# EAGLE schematic WirelessNRF24 (EAGLE 7.3.0)
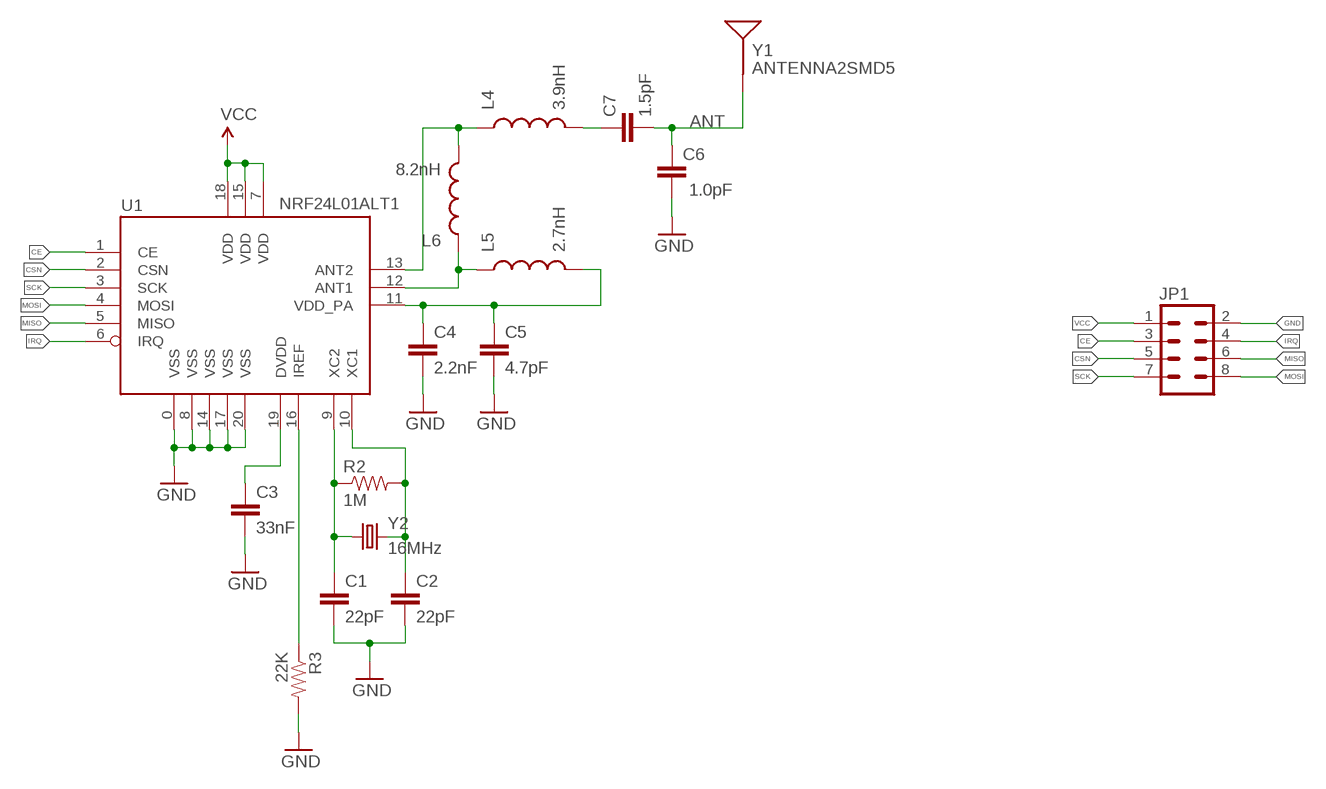
[diagram p0: schematic, sheet 1]

## Parts
C1  22pF  CAP0603-CAP  [0603-CAP]
C2  22pF  CAP0603-CAP  [0603-CAP]
C3  33nF  CAP0603-CAP  [0603-CAP]
C4  2.2nF  CAP0603-CAP  [0603-CAP]
C5  4.7pF  CAP0603-CAP  [0603-CAP]
C6  1.0pF  CAP0603-CAP  [0603-CAP]
C7  1.5pF  CAP0603-CAP  [0603-CAP]
JP1  M04X2_0.05"  [M04X2_0.05"]
L4  3.9nH  INDUCTOR0603  [0603]
L5  2.7nH  INDUCTOR0603  [0603]
L6  8.2nH  INDUCTOR0603  [0603]
R2  1M  RESISTOR0603-RES  [0603-RES]
R3  22K  RESISTOR0603-RES  [0603-RES]
U1  NRF24L01ALT1  [QFN20_ALT1]
Y1  ANTENNA2SMD5  [ANTENNA-CHIP5]
Y2  16MHz  CRYSTALTXC-7A  [CRYSTAL-TXC-7A]

## Nets
ANT: C6.2 C7.2 Y1.FEED(SIGNAL)
CE: JP1.3 U1.1(CE)
CSN: JP1.5 U1.2(CSN)
GND: C1.2 C2.2 C3.2 C4.2 C5.2 C6.1 JP1.2 R3.2 U1.0(VSS) U1.8(VSS) U1.14(VSS) U1.17(VSS) U1.20(VSS)
IRQ: JP1.4 U1.6(IRQ)
MISO: JP1.6 U1.5(MISO)
MOSI: JP1.8 U1.4(MOSI)
N$1: C1.1 R2.1 U1.9(XC2) Y2.P$1
N$2: C2.1 R2.2 U1.10(XC1) Y2.P$2
N$3: L5.1 L6.1 U1.12(ANT1)
N$4: R3.1 U1.16(IREF)
N$5: C3.1 U1.19(DVDD)
N$6: L4.1 L6.2 U1.13(ANT2)
N$7: C4.1 C5.1 L5.2 U1.11(VDD_PA)
N$9: C7.1 L4.2
SCK: JP1.7 U1.3(SCK)
VCC: JP1.1 U1.7(VDD) U1.15(VDD) U1.18(VDD)

## Library data of the parts
C1-C7 = SparkFun:CAP: Capacitor Standard 0603 ceramic capacitor, and 0.1" leaded capacitor.
JP1 = MakerWear:M04X2_0.05": .1" header, two rows of four.
L4-L6 = SparkFun-Passives:INDUCTOR: Inductors Basic Inductor/Choke - 0603 and 1206. Footprints are not proven and vary greatly between part numbers. INDUCTOR POWER 3.3UH 4.0A SMD 0.197" L x 0.197" W x 0.177" H (5.00mm x 5.00mm x 4.50mm)
R2 R3 = SparkFun:RESISTOR: Resistor Basic schematic elements and footprints for 0603, 1206, and PTH resistors.
U1 = Testing:NRF24L01: 2.4GHz Low Power Transceiver This is the very popular, low cost, very low power RF transceiver from Nordic Semiconductor. Simple SPI interface. SKU: COM-00690
Y1 = SparkFun:ANTENNA2: Antenna Single endded antenna. Common with smaller chip antennas. CHIP4 package is the GPS Chip Antenna SKU: GPS-08418. CHIP5 package is 2.4GHz chip antenna SKU: WRL-00144.
Y2 = SparkFun-FreqCtrl:CRYSTAL: Various standard crystals. Proven footprints.